# Altium project project.PrjPCB
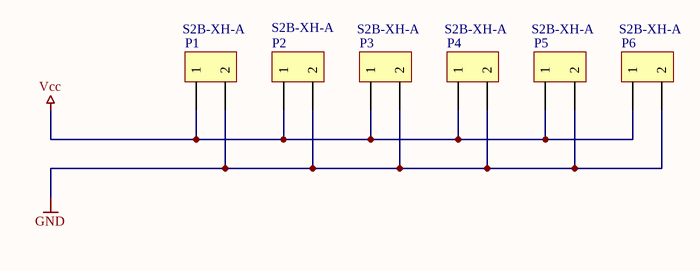
[diagram p0: schematic.SchDoc]
1 sheet, 6 parts. Net scope: global (net labels, ports and power ports of the same name join across sheets).
Board file: ring_pcb.PcbDoc

## Sheet schematic.SchDoc
size A4

### Parts
P1  S2B-XH-A  [S2B-XH-A]
P2  S2B-XH-A  [S2B-XH-A]
P3  S2B-XH-A  [S2B-XH-A]
P4  S2B-XH-A  [S2B-XH-A]
P5  S2B-XH-A  [S2B-XH-A]
P6  S2B-XH-A  [S2B-XH-A]

### Nets
GND: P1.2 P2.2 P3.2 P4.2 P5.2 P6.2
Vcc: P1.1 P2.1 P3.1 P4.1 P5.1 P6.1

### Library data of the parts
P1-P6 = S2B-XH-A: JST pin header, 2.54 mm pitch, angled